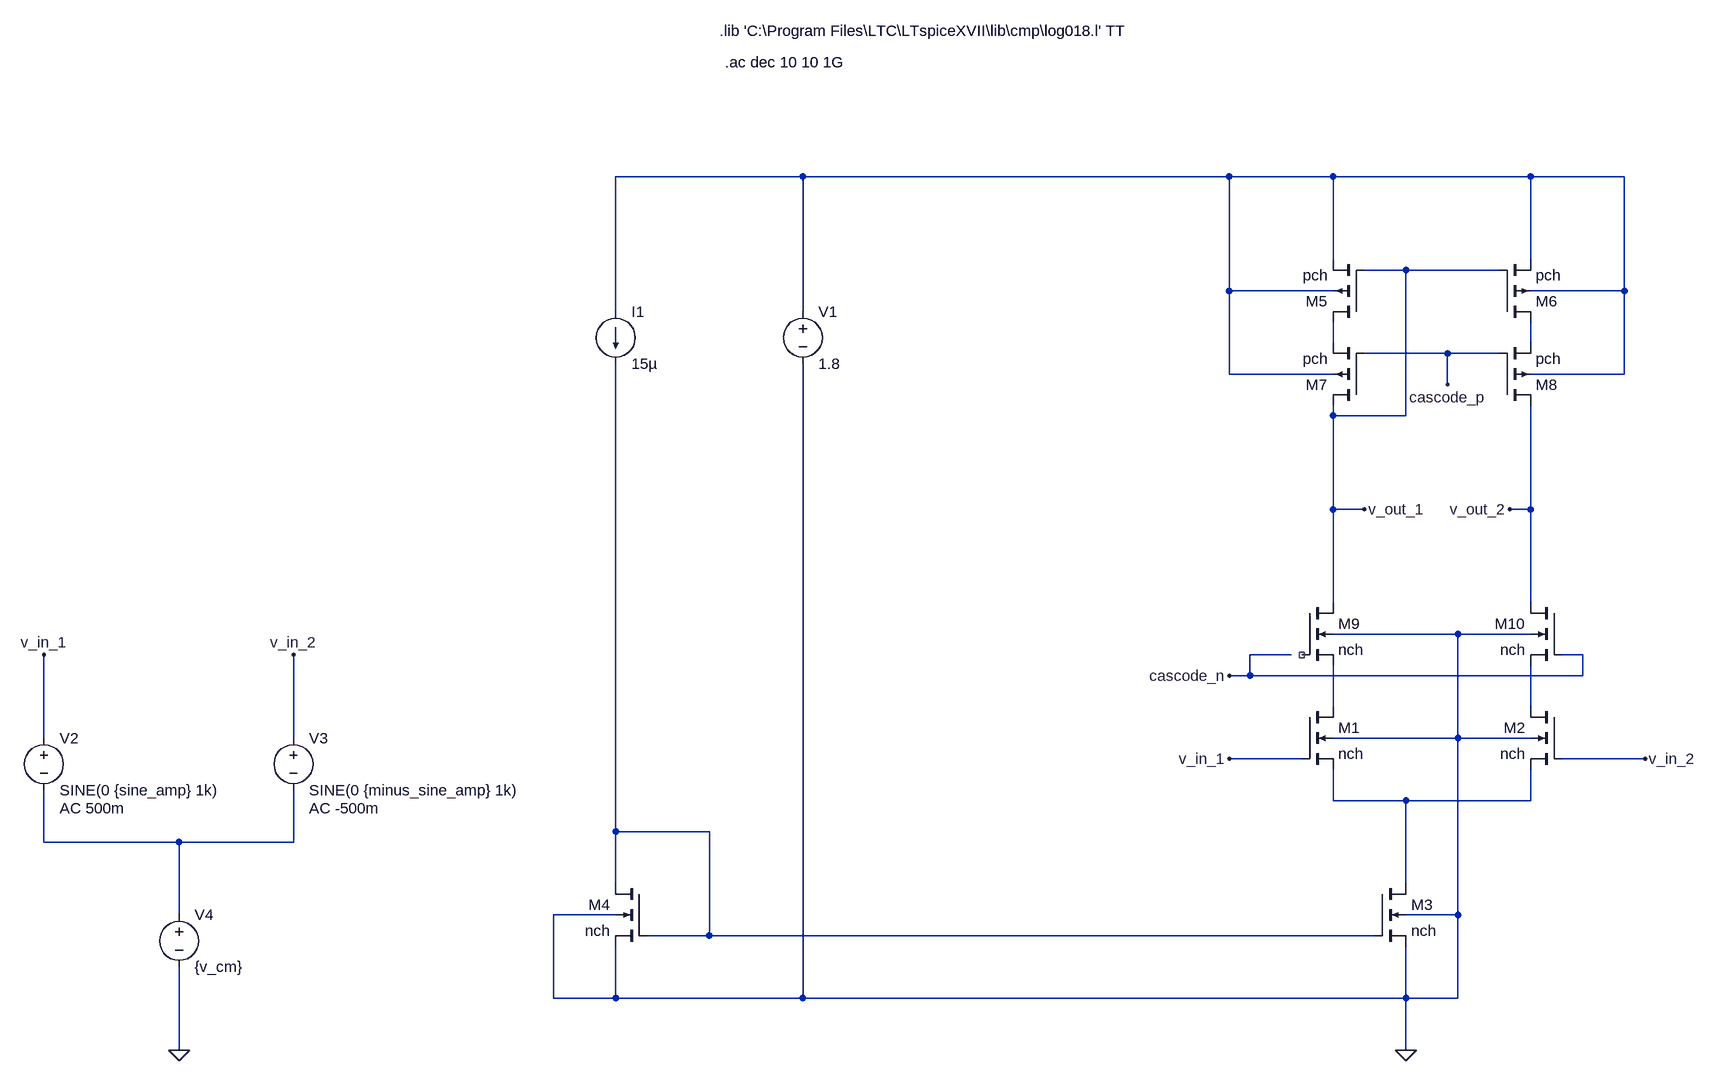
[diagram p0: schematic differential-pair-current-mirror.asc]
differential-pair-current-mirror.asc, the LTspice schematic file:
Version 4
SHEET 1 1744 1492
WIRE -208 128 -496 128
WIRE 448 128 -208 128
WIRE 608 128 448 128
WIRE 912 128 608 128
WIRE 1056 128 912 128
WIRE 608 256 608 128
WIRE 912 256 912 128
WIRE 720 272 656 272
WIRE 864 272 720 272
WIRE 448 304 448 128
WIRE 608 304 448 304
WIRE 1056 304 1056 128
WIRE 1056 304 912 304
WIRE -496 336 -496 128
WIRE -208 336 -208 128
WIRE 608 384 608 352
WIRE 912 384 912 352
WIRE 784 400 656 400
WIRE 864 400 784 400
WIRE 448 432 448 304
WIRE 608 432 448 432
WIRE 1056 432 1056 304
WIRE 1056 432 912 432
WIRE 784 448 784 400
WIRE 608 496 608 480
WIRE 720 496 720 272
WIRE 720 496 608 496
WIRE 608 640 608 496
WIRE 656 640 608 640
WIRE 912 640 912 480
WIRE 912 640 880 640
WIRE 608 784 608 640
WIRE 912 784 912 640
WIRE 800 832 608 832
WIRE 912 832 800 832
WIRE 544 864 480 864
WIRE 992 864 960 864
WIRE 480 896 480 864
WIRE 480 896 448 896
WIRE 992 896 992 864
WIRE 992 896 480 896
WIRE 608 944 608 880
WIRE 912 944 912 880
WIRE -1376 992 -1376 864
WIRE -992 992 -992 864
WIRE 800 992 800 832
WIRE 800 992 608 992
WIRE 912 992 800 992
WIRE 560 1024 448 1024
WIRE 1088 1024 960 1024
WIRE 608 1088 608 1040
WIRE 720 1088 608 1088
WIRE 912 1088 912 1040
WIRE 912 1088 720 1088
WIRE -496 1136 -496 416
WIRE -352 1136 -496 1136
WIRE -1376 1152 -1376 1072
WIRE -1168 1152 -1376 1152
WIRE -992 1152 -992 1072
WIRE -992 1152 -1168 1152
WIRE -496 1216 -496 1136
WIRE 720 1216 720 1088
WIRE -1168 1264 -1168 1152
WIRE -496 1264 -592 1264
WIRE 800 1264 800 992
WIRE 800 1264 720 1264
WIRE -352 1296 -352 1136
WIRE -352 1296 -448 1296
WIRE 672 1296 -352 1296
WIRE -592 1392 -592 1264
WIRE -496 1392 -496 1312
WIRE -496 1392 -592 1392
WIRE -208 1392 -208 416
WIRE -208 1392 -496 1392
WIRE 720 1392 720 1312
WIRE 720 1392 -208 1392
WIRE 800 1392 800 1264
WIRE 800 1392 720 1392
WIRE -1168 1472 -1168 1344
WIRE 720 1472 720 1392
FLAG 720 1472 0
FLAG -1168 1472 0
FLAG 448 1024 v_in_1
FLAG 1088 1024 v_in_2
FLAG -1376 864 v_in_1
FLAG -992 864 v_in_2
FLAG 656 640 v_out_1
FLAG 880 640 v_out_2
FLAG 784 448 cascode_p
FLAG 448 896 cascode_n
SYMBOL nmos4 560 944 R0
SYMATTR InstName M1
SYMATTR Value nch
SYMATTR Value2 l=1u w=15u
SYMBOL nmos4 960 944 M0
SYMATTR InstName M2
SYMATTR Value nch
SYMATTR Value2 l=1u w=15u
SYMBOL nmos4 672 1216 R0
SYMATTR InstName M3
SYMATTR Value nch
SYMATTR Value2 l=1u w=30u
SYMBOL nmos4 -448 1216 M0
SYMATTR InstName M4
SYMATTR Value nch
SYMATTR Value2 l=1u w=15u
SYMBOL pmos4 656 352 R180
SYMATTR InstName M5
SYMATTR Value pch
SYMATTR Value2 l=1u w=30u
SYMBOL pmos4 864 352 M180
SYMATTR InstName M6
SYMATTR Value pch
SYMATTR Value2 l=1u w=30u
SYMBOL current -496 336 R0
SYMATTR InstName I1
SYMATTR Value 15µ
SYMBOL voltage -208 320 R0
WINDOW 123 0 0 Left 0
WINDOW 39 0 0 Left 0
SYMATTR InstName V1
SYMATTR Value 1.8
SYMBOL voltage -1376 976 R0
WINDOW 123 24 124 Left 2
WINDOW 39 0 0 Left 0
SYMATTR Value2 AC 500m
SYMATTR InstName V2
SYMATTR Value SINE(0 {sine_amp} 1k)
SYMBOL voltage -1168 1248 R0
WINDOW 123 0 0 Left 0
WINDOW 39 0 0 Left 0
SYMATTR InstName V4
SYMATTR Value {v_cm}
SYMBOL voltage -992 976 R0
WINDOW 123 24 124 Left 2
WINDOW 39 0 0 Left 0
SYMATTR Value2 AC -500m
SYMATTR InstName V3
SYMATTR Value SINE(0 {minus_sine_amp} 1k)
SYMBOL pmos4 656 480 R180
SYMATTR InstName M7
SYMATTR Value pch
SYMATTR Value2 l=1u w=30u
SYMBOL pmos4 864 480 M180
SYMATTR InstName M8
SYMATTR Value pch
SYMATTR Value2 l=1u w=30u
SYMBOL nmos4 560 784 R0
SYMATTR InstName M9
SYMATTR Value nch
SYMATTR Value2 l=1u w=15u
SYMBOL nmos4 960 784 M0
SYMATTR InstName M10
SYMATTR Value nch
SYMATTR Value2 l=1u w=15u
TEXT -336 -96 Left 2 !.lib 'C:\\Program Files\\LTC\\LTspiceXVII\\lib\\cmp\\log018.l' TT
TEXT -328 -48 Left 2 !.ac dec 10 10 1G

The netlist it stands for:
* differential-pair-current-mirror.asc
M1 N004 v_in_1 N006 0 nch l=1u w=15u
M2 N005 v_in_2 N006 0 nch l=1u w=15u
M3 N006 N007 0 0 nch l=1u w=30u
M4 N007 N007 0 0 nch l=1u w=15u
M5 N002 v_out_1 N001 N001 pch l=1u w=30u
M6 N003 v_out_1 N001 N001 pch l=1u w=30u
I1 N001 N007 15µ
V1 N001 0 1.8
V2 v_in_1 N008 SINE(0 {sine_amp} 1k) AC 500m
V4 N008 0 {v_cm}
V3 v_in_2 N008 SINE(0 {minus_sine_amp} 1k) AC -500m
M7 v_out_1 cascode_p N002 N001 pch l=1u w=30u
M8 v_out_2 cascode_p N003 N001 pch l=1u w=30u
M9 v_out_1 NC_01 N004 0 nch l=1u w=15u
M10 v_out_2 cascode_n N005 0 nch l=1u w=15u
.model NMOS NMOS
.model PMOS PMOS
.lib standard.mos
.lib 'C:\Program Files\LTC\LTspiceXVII\lib\cmp\log018.l' TT
.ac dec 10 10 1G
.backanno
.end